# Altium project aig2_revA.PrjPcb
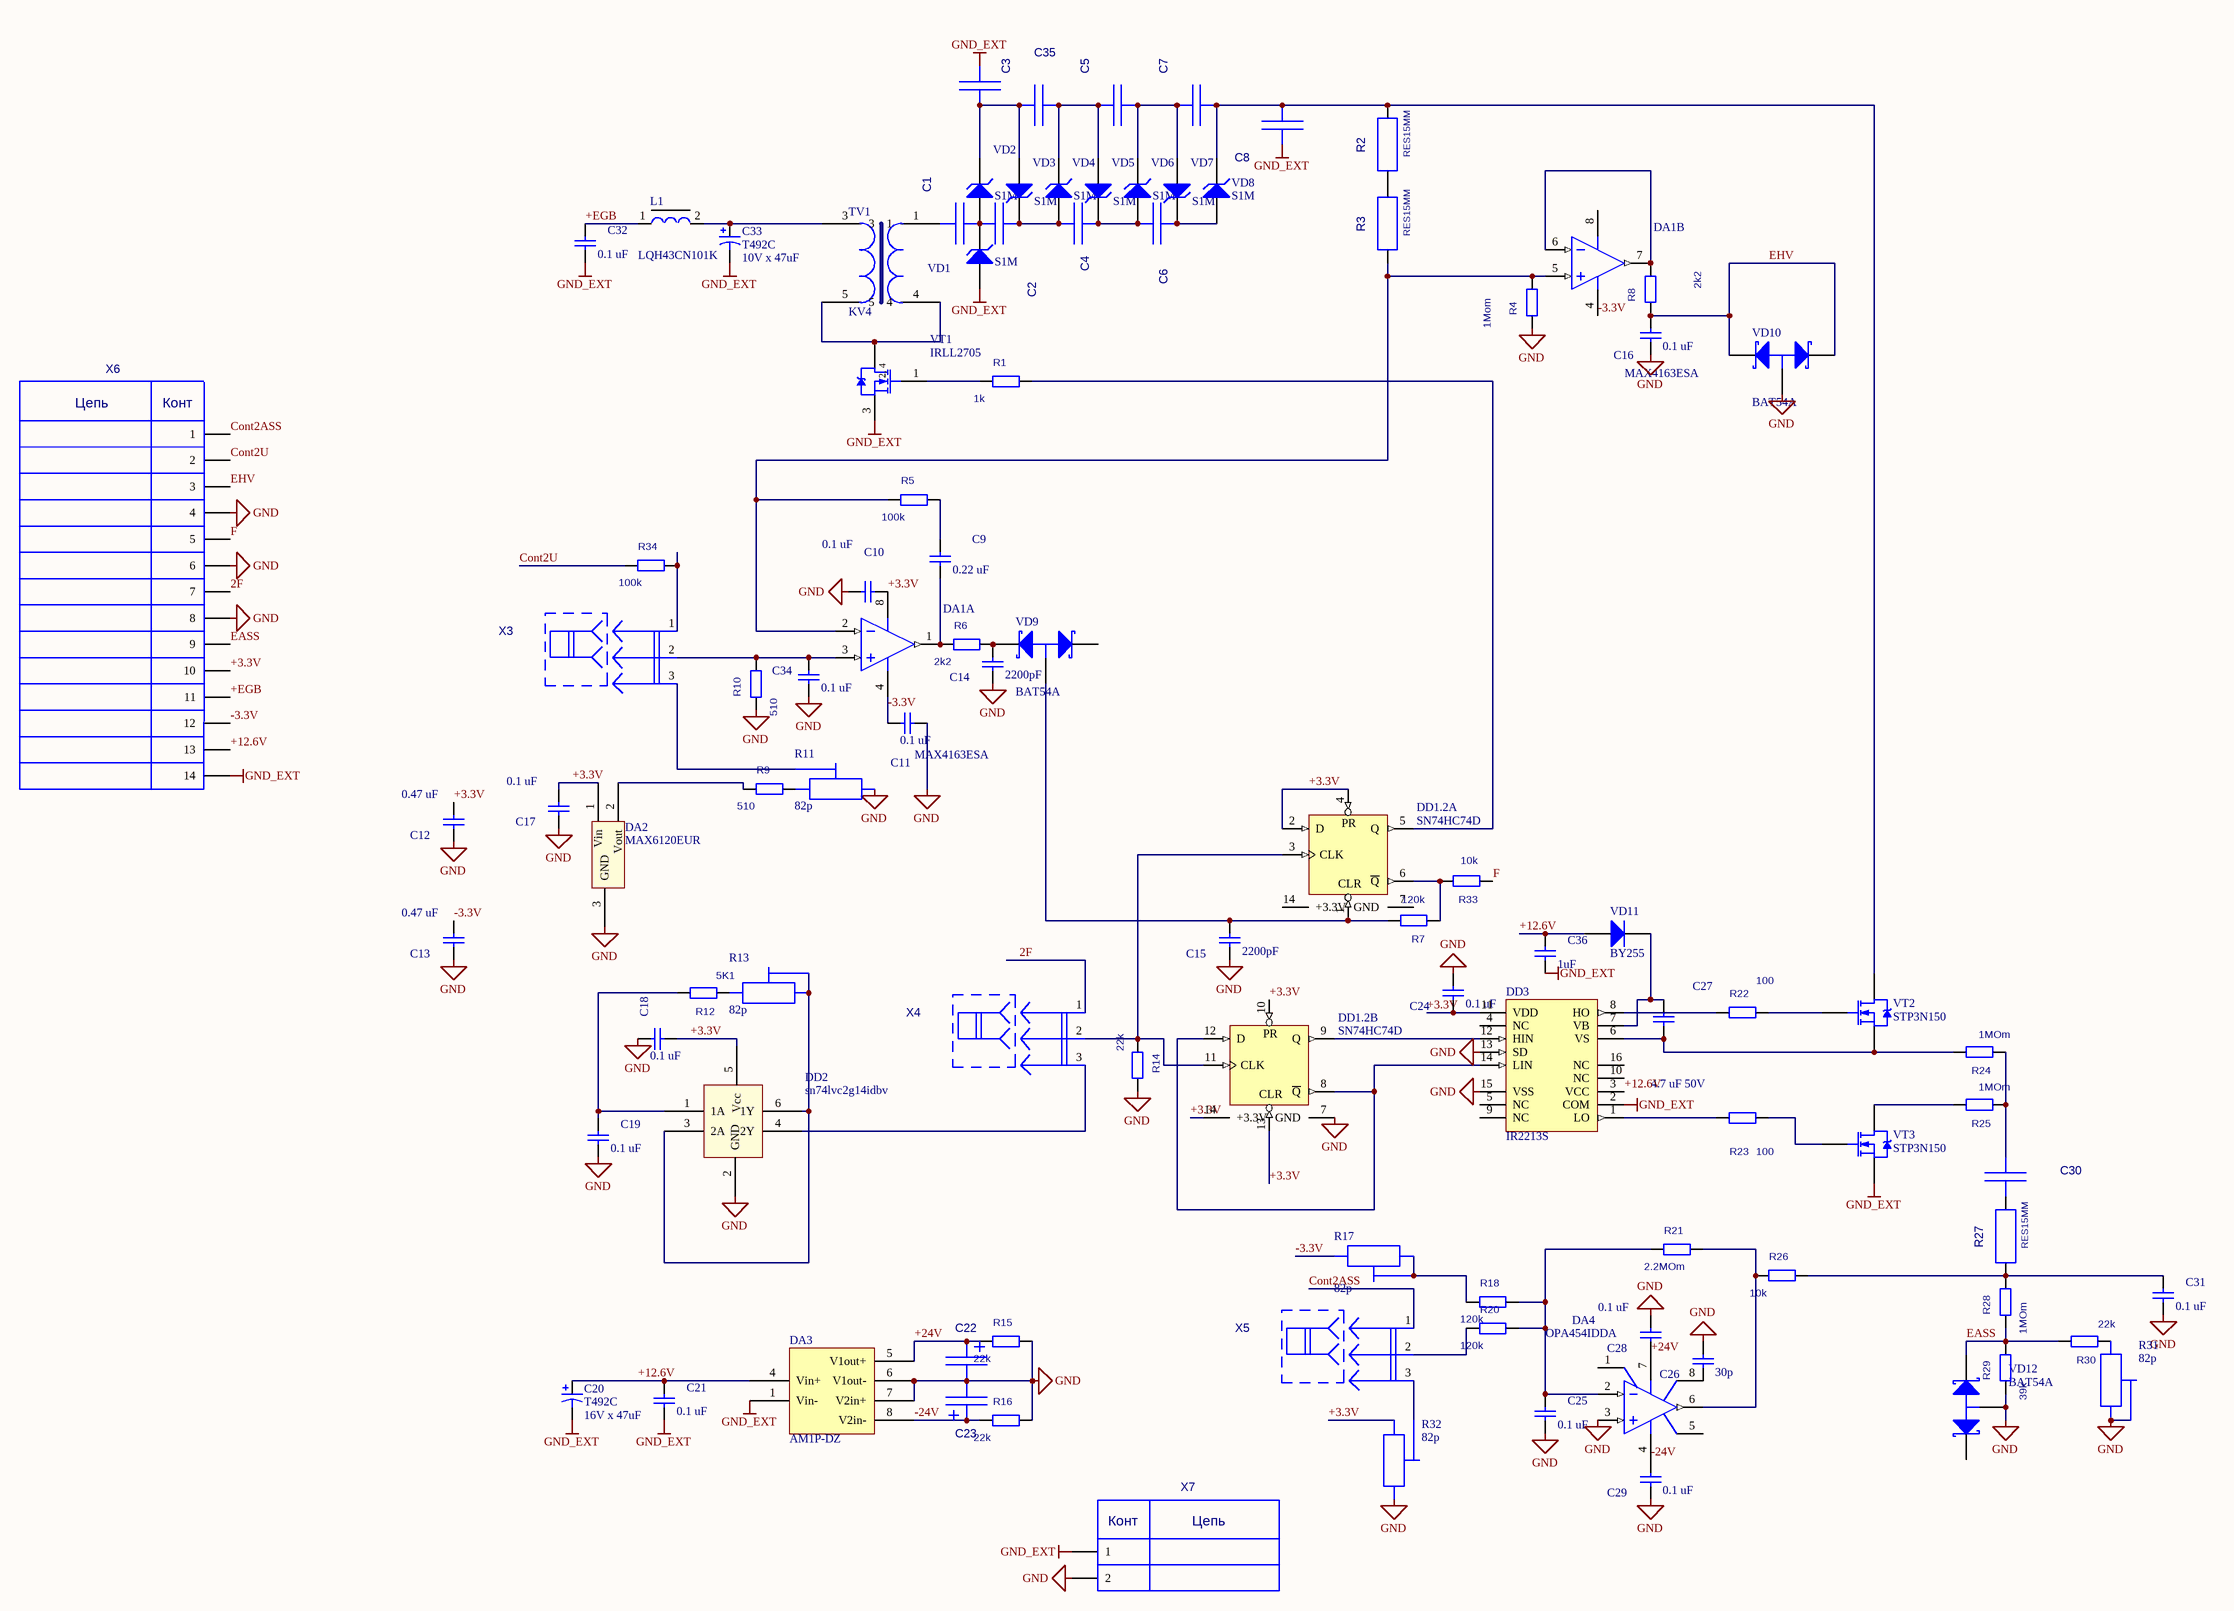
[diagram p0: aig2.SchDoc]
1 sheet, 98 parts. Net scope: global (net labels, ports and power ports of the same name join across sheets).
Board file: aig2.PcbDoc

## Sheet aig2.SchDoc
size A0

### Parts
C1  CC1812  [CC1812]  (value not drawn)
C2  CC1812  [CC1812]  (value not drawn)
C3  CC1812  [CC1812]  (value not drawn)
C4  CC1812  [CC1812]  (value not drawn)
C5  CC1812  [CC1812]  (value not drawn)
C6  CC1812  [CC1812]  (value not drawn)
C7  CC1812  [CC1812]  (value not drawn)
C8  CC1812  [CC1812]  (value not drawn)
C9  value 0.22 uF  [CC0805]  (hidden comment: C0805)
C10  value 0.1 uF  [CC0805]  (hidden comment: C0805)
C11  value 0.1 uF  [CC0805]  (hidden comment: C0805)
C12  value 0.47 uF  [CC0805]  (hidden comment: C0805)
C13  value 0.47 uF  [CC0805]  (hidden comment: C0805)
C14  value 2200pF  [CC0805]  (hidden comment: C0805)
C15  value 2200pF  [CC0805]  (hidden comment: C0805)
C16  value 0.1 uF  [CC0805]  (hidden comment: C0805)
C17  value 0.1 uF  [CC0805]  (hidden comment: C0805)
C18  value 0.1 uF  [CC0805]  (hidden comment: C0805)
C19  value 0.1 uF  [CC0805]  (hidden comment: C0805)
C20  T492C  value 16V x 47uF  [CAPASITOR C]
C21  value 0.1 uF  [CC0805]  (hidden comment: C0805)
C22  CAPASITOR A  [CAPASITOR A]  (value not drawn)
C23  CAPASITOR A  [CAPASITOR A]  (value not drawn)
C24  value 0.1 uF  [CC0805]  (hidden comment: C0805)
C25  value 0.1 uF  [CC0805]  (hidden comment: C0805)
C26  value 30p  [CC0805]  (hidden comment: C0805)
C27  value 4.7 uF 50V  [CC0805]  (hidden comment: C0805)
C28  value 0.1 uF  [CC0805]  (hidden comment: C0805)
C29  value 0.1 uF  [CC0805]  (hidden comment: C0805)
C30  CC1812  [CC1812]  (value not drawn)
C31  value 0.1 uF  [CC0805]  (hidden comment: C0805)
C32  value 0.1 uF  [CC0805]  (hidden comment: C0805)
C33  T492C  value 10V x 47uF  [CAPASITOR C]
C34  value 0.1 uF  [CC0805]  (hidden comment: C0805)
C35  CC1812  [CC1812]  (value not drawn)
C36  value 1uF  [CC0805]  (hidden comment: C0805)
DA1  MAX4163ESA  [NSO8_N]  (parts A,B of 2)
DA2  MAX6120EUR  [sot23]
DA3  AM1P-DZ  [Am1p]
DA4  OPA454IDDA  [182H_N]
DD1.2  SN74HC74D  [D014_N]  (parts A,B of 2)
DD2  sn74lvc2g14idbv  [sot23-6_N]
DD3  IR2213S  [SOIC16_N]
L1  LQH43CN101K  [1812]
R1  value 1k  [RR0805]
R2  RES15MM  [RES15MM]
R3  RES15MM  [RES15MM]
R4  value 1Mom  [RR0805]
R5  value 100k  [RR0805]
R6  value 2k2  [RR0805]
R7  value 120k  [RR0805]
R8  value 2k2  [RR0805]
R9  value 510  [RR0805]
R10  value 510  [RR0805]
R11  82p  [82p]
R12  value 5K1  [RR0805]
R13  82p  [82p]
R14  value 22k  [RR0805]
R15  value 22k  [RR0805]
R16  value 22k  [RR0805]
R17  82p  [82p]
R18  value 120k  [RR0805]
R20  value 120k  [RR0805]
R21  value 2.2MOm  [RR0805]
R22  value 100  [RR0805]
R23  value 100  [RR0805]
R24  value 1MOm  [RR0805]
R25  value 1MOm  [RR0805]
R26  value 10k  [RR0805]
R27  RES15MM  [RES15MM]
R28  value 1MOm  [RR0805]
R29  value 39k  [RR0805]
R30  value 22k  [RR0805]
R31  82p  [82p]
R32  82p  [82p]
R33  value 10k  [RR0805]
R34  value 100k  [RR0805]
TV1  KV4  [kv4]
VD1  S1M  [DO214]
VD2  S1M  [DO214]
VD3  S1M  [DO214]
VD4  S1M  [DO214]
VD5  S1M  [DO214]
VD6  S1M  [DO214]
VD7  S1M  [DO214]
VD8  S1M  [DO214]
VD9  BAT54A  [SOT23_N]
VD10  BAT54A  [SOT23_N]
VD11  BY255  [SOD27]
VD12  BAT54A  [SOT23_N]
VT1  IRLL2705  [SOT-223]
VT2  STP3N150  [TO-220AB]
VT3  STP3N150  [TO-220AB]
X3  JP3  [PLS-3 2.54]  (value not drawn)
X4  JP3  [PLS-3 2.54]  (value not drawn)
X5  JP3  [PLS-3 2.54]  (value not drawn)
X6  IDC14M  [IDC14M]  (value not drawn)
X7  PLS-2  [PLS-2 2.54]  (value not drawn)

### Nets
+3.3V: C10.2 C12.1 C17.1 C18.1 C24.2 DA1.8(VDD) DA2.1(Vin) DD1.2.2(D) DD1.2.4(PR) DD1.2.10(PR) DD1.2.13(CLR) DD1.2.14(+3.3V) DD2.5(Vcc) DD3.11(VDD) R32.1(I/O1) X6.10  [also labelled VCC]
GND: C10.1 C11.1 C12.2 C13.2 C14.2 C15.2 C16.2 C17.2 C18.2 C19.1 C22.2(i/o1) C23.2(i/o1) C24.1 C25.1 C26.1 C28.1 C29.2 C31.1 C34.1 DA2.3(GND) DA3.6(V1out-) DA3.7(V2in+) DA4.3(IN+) DD1.2.7(GND) DD2.2(GND) DD3.13(SD) DD3.15(VSS) R4.1 R10.1 R11.3(I/O) R14.2 R15.2 R16.2 R29.1 R31.1(I/O1) R31.2(I/O0) R32.3(I/O) VD10.3(A) VD12.3(A) X6.4 X6.6 X6.8 X7.2
GND_EXT: C8.1(i/o) C20.2 C21.1 C32.1 C33.2 C35.2(i/o1) C36.1 DA3.1(Vin-) DD3.2(COM) VD1.1(A) VT1.3(S) VT3.3(S) X6.14 X7.1
2F: X4.1(I/O1) X6.7
+12.6V: C20.1 C21.2 C36.2 DA3.4(Vin+) DD3.3(VCC) VD11.1(A) X6.13
+24V: C22.1(i/o) C28.2 DA3.5(V1out+) DA4.7(V+) R15.1
+EGB: C32.2 L1.1 X6.11
-3.3V: C11.2 C13.1 DA1.4(VSS) R17.3(I/O) X6.12
-24V: C23.1(i/o) C29.1 DA3.8(V2in-) DA4.4(V-) R16.1
Cont2ASS: X5.1(I/O1) X6.1
Cont2U: R34.1 X6.2
EASS: R28.1 R29.2 R30.2 VD12.1(K1) X6.9
EHV: C16.1 R8.1 VD10.1(K1) VD10.2(K2) X6.3
F: R33.1 X6.5
NetC1_1: C1.1(i/o) TV1.1
NetC1_2: C1.2(i/o1) C2.1(i/o) VD1.2(K) VD2.1(A)
NetC2_2: C2.2(i/o1) C4.1(i/o) VD3.2(K) VD4.1(A)
NetC3_1: C3.1(i/o) C35.1(i/o) VD2.2(K) VD3.1(A)
NetC3_2: C3.2(i/o1) C5.1(i/o) VD4.2(K) VD5.1(A)
NetC4_2: C4.2(i/o1) C6.1(i/o) VD5.2(K) VD6.1(A)
NetC5_2: C5.2(i/o1) C7.1(i/o) VD6.2(K) VD7.1(A)
NetC6_2: C6.2(i/o1) VD7.2(K) VD8.1(A)
NetC7_2: C7.2(i/o1) C8.2(i/o1) R2.2(I/O1) VD8.2(K) VT2.2(D)
NetC9_1: C9.1 R5.2
NetC9_2: C9.2 DA1.1(OUT) R6.1
NetC14_1: C14.1 R6.2 VD9.1(K1)
NetC15_1: C15.1 DD1.2.1(CLR) R7.2 VD9.3(A)
NetC19_2: C19.2 DD2.1(1A) R12.2
NetC25_2: C25.2 DA4.2(IN-) R18.2 R20.2 R21.1
NetC26_2: C26.2 DA4.8(VOSTRIM)
NetC27_1: C27.1 DD3.6(VS) R24.2 VT2.3(S)
NetC27_2: C27.2 DD3.7(VB) VD11.2(K)
NetC30_1: C30.1(i/o) R24.1 R25.1
NetC30_2: C30.2(i/o1) R27.2(I/O1)
NetC31_2: C31.2 R26.2 R27.1(I/O0) R28.2
NetC33_1: C33.1 L1.2 TV1.3
NetC34_2: C34.2 DA1.3(IN+) R10.2 X3.2(I/O2)
NetDA1_2: DA1.2(IN-) DA1.5(IN+) R3.1(I/O0) R4.2 R5.1
NetDA1_6: DA1.6(IN-) DA1.7(OUT) R8.2
NetDA2_2: DA2.2(Vout) R9.1
NetDA4_6: DA4.6(OUT) R21.2 R26.1
NetDD1.2_3: DD1.2.3(CLK) DD1.2.11(CLK) R14.1 X4.2(I/O2)
NetDD1.2_5: DD1.2.5(Q) R1.2
NetDD1.2_6: DD1.2.6(~{Q}) R7.1 R33.2
NetDD1.2_8: DD1.2.8(~{Q}) DD1.2.12(D) DD3.14(LIN)
NetDD1.2_9: DD1.2.9(Q) DD3.12(HIN)
NetDD2_3: DD2.3(2A) DD2.6(1Y) R13.1(I/O1) R13.2(I/O0)
NetDD2_4: DD2.4(2Y) X4.3(I/O3)
NetDD3_1: DD3.1(LO) R23.1
NetDD3_8: DD3.8(HO) R22.1
NetR1_1: R1.1 VT1.1(G)
NetR2_1: R2.1(I/O0) R3.2(I/O1)
NetR9_2: R9.2 R11.1(I/O1)
NetR11_2: R11.2(I/O0) X3.3(I/O3)
NetR12_1: R12.1 R13.3(I/O)
NetR17_1: R17.1(I/O1) R17.2(I/O0) R18.1
NetR20_1: R20.1 X5.2(I/O2)
NetR22_2: R22.2 VT2.1(G)
NetR23_2: R23.2 VT3.1(G)
NetR25_2: R25.2 VT3.2(D)
NetR30_1: R30.1 R31.3(I/O)
NetR32_2: R32.2(I/O0) X5.3(I/O3)
NetR34_2: R34.2 X3.1(I/O1)
NetTV1_4: TV1.4 TV1.5 VT1.2(D) VT1.4(D)

Not connected (* = marked no-connect by the designer): DA4 1(VOSTRIM) 5(NC); DD3 4(NC) 5(NC) 9(NC) 10(NC) 16(NC); VD9 2(K2); VD12 2(K2)

### Notes on the sheet
- (in symbol IDC14M) Цепь; Конт
- (in symbol IRLL2705) 2, 4
- (in symbol PLS-2) Конт; Цепь

### Library data of the parts
C1-C7 C30 C35 = CC1812: Value: 2200 x 1kV
C8 = CC1812: Value: 2200 x 3kV
C9-C19 C21 C24-C29 C31 C32 C34 C36 = C0805: Ceramic Chip Capacitor - Standard; Note: Footprint corresponds to dimensions for bulk cassette packaging. This case size has tightened tolerances.; Published: 17-Jul-2002; LatestRevisionDate: 19-Mar-2004; LatestRevisionNote: Silkscreen size reduced.; DatasheetDocument: Mar-2001; PackageDocument: Mar-2001; PackageReference: 0805; Publisher: Altium Limited; Code_JEITA: 0805; Code_IPC: 2012[0805]; ComponentLink1Description: Manufacturer Link; ComponentLink1URL: http://www.kemet.com/; ComponentLink2Description: Datasheet; ComponentLink2URL: http://www.kemet.com/kemet/web/homepage/kechome.nsf/vapubfilesname/F3102TA.pdf/$file/F3102TA.pdf
C20 C33 = T492C: Solid Tantalum Chip Capacitor, T492 Series - CWR11 Style Per Mil-PRF-55365/8; Published: 17-Jul-2002; LatestRevisionDate: 19-Mar-2004; LatestRevisionNote: Silkscreen dimensions re-sized.; DatasheetDocument: Mar-2001; PackageDocument: Mar-2001; PackageReference: C; Publisher: Altium Limited; Code_JEITA: 6032-28; ComponentLink1Description: Manufacturer Link; ComponentLink1URL: http://www.kemet.com/; ComponentLink2Description: Datasheet; ComponentLink2URL: http://www.kemet.com/kemet/web/homepage/kechome.nsf/vapubfilesname/F3102TA.pdf/$file/F3102TA.pdf
DA1 = MAX4163ESA: Dual Micropower, Single-Supply, Rail-to-Rail I/O Op Amp; Published: 23-Sep-2002; LatestRevisionDate: 13-Apr-2006; LatestRevisionNote: IPC-7351 Footprint Added.; DatasheetVersion: Rev 0; 4/97; PackageReference: NSO8; Publisher: Altium Limited; PackageDescription: 8-Pin Small Outline Integrated Circuit 1.27 mm Pitch; Code_JEDEC: MS-012-AA; Code_IPC: SOIC127P600-8; ComponentLink1Description: Manufacturer Link; ComponentLink1URL: http://www.maxim-ic.com/; ComponentLink2Description: Datasheet; ComponentLink2URL: http://pdfserv.maxim-ic.com/en/ds/MAX4162-MAX4164.pdf
DA2 = MAX6120: Микросхема
DA3 = AM1P-DZ: DC/DC Перобразователь
DA4 = OPA27GU: Ultra-Low-Noise Precision Operational Amplifiers; Note: Pin 5 is No internal Connection (NC) pin.; Published: 8-Jun-2000; LatestRevisionDate: 13-Apr-2006; LatestRevisionNote: IPC-7351 Footprint Added.; DatasheetVersion: Mar-1998; PackageReference: 182H; Publisher: Altium Limited; PackageDescription: 8-Pin Small Outline Integrated Circuit 1.27 mm Pitch; Code_JEDEC: MS-012-AA; Code_IPC: SOIC127P600-8; ComponentLink1Description: Manufacturer Link; ComponentLink1URL: http://www.ti.com/; ComponentLink2Description: Datasheet; ComponentLink2URL: http://www-s.ti.com/sc/ds/OPA27.pdf
DD1.2 = SN74HC74D: Dual D-Type Positive-Edge-Triggered Flip-Flop with Clear and Preset; Published: 8-Jun-2000; LatestRevisionDate: 13-Apr-2006; LatestRevisionNote: IPC-7351 Footprint Added.; DatasheetVersion: May-1997; PackageVersion: Jan-1998; PackageReference: D014; Publisher: Altium Limited; PackageDescription: 14-Pin Small Outline Integrated Circuit 1.27 mm Pitch; Code_IPC: SOIC127P600-14; ComponentLink1Description: Manufacturer Link; ComponentLink1URL: http://www.ti.com/; ComponentLink2Description: Datasheet; ComponentLink2URL: http://www-s.ti.com/sc/ds/sn74hc74.pdf
DD2 = sn74lvc2g14idbv: Микросхема
DD3 = IR2113S: High and Low Side Driver; Note: Pins 4, 5, 9, 10 and 16 are not connected; Published: 8-Jun-2000; LatestRevisionDate: 13-Apr-2006; LatestRevisionNote: IPC-7351 Footprint Added.; DatasheetVersion: PD60147J; PackageReference: SOIC16; Publisher: Altium Limited; PackageDescription: 16-Pin Small Outline Integrated Circuit 1.27 mm Pitch; Code_JEDEC: MS-013-AA; Code_IPC: SOIC127P1030-16; ComponentLink1Description: Manufacturer Link; ComponentLink1URL: http://www.irf.com/; ComponentLink2Description: Datasheet; ComponentLink2URL: http://www.irf.com/product-info/datasheets/data/ir2110.pdf
L1 = CDRH127: Дроссель
R1 R4-R10 R12 R14-R16 R18 R20-R26 R28-R30 R33 R34 = R_0805: Price: {Price}
R11 R13 R17 R31 R32 = 82p: Резистор; Value: *
TV1 = KV4: Трансформатор
VD1-VD8 = BZG03C10: Silicon Zener Diode (3W); Published: 8-Jun-2000; LatestRevisionDate: 17-Jul-2002; LatestRevisionNote: Re-released for DXP Platform.; DatasheetDocument: 1-Apr-1999; PackageDocument: Apr-1999; PackageReference: DO214; Publisher: Altium Limited; ComponentLink1Description: Manufacturer Link; ComponentLink1URL: http://www.vishay.com/; ComponentLink2Description: Datasheet; ComponentLink2URL: http://www.vishay.com/docs/85593/85593.pdf
VD9 VD10 VD12 = BAT54A: Schottky Barrier Double Diode; Published: 17-Sep-2003; LatestRevisionDate: 12-Dec-2006; LatestRevisionNote: IPC-7351 Footprint Added.; DatasheetVersion: 4-Mar-2002; PackageVersion: May-1999; PackageReference: SOT23; Publisher: Altium Limited; PackageDescription: 3-Pin SOT-23 Package 0.95 mm Pitch, 2.3 mm Lead Span; ComponentLink1Description: Manufacturer Link; ComponentLink1URL: http://www.semiconductors.philips.com/; ComponentLink2Description: Datasheet; ComponentLink2URL: http://www.semiconductors.philips.com/acrobat/datasheets/BAT54_SERIES_4.pdf
VD11 = BZX79-B15: Диод; Code_IEC: A24; Published: 17-Sep-2003; DatasheetVersion: 27-Feb-2002; PackageVersion: Apr-1999; PackageReference: SOD27; Publisher: Altium Limited; PackageDescription: Diode, Axial; Body 4.3 x 1.9 mm (LxDia. max), Lead Dia. 0.56 mm (max); Code_JEITA: SC-40; Code_JEDEC: DO-35; ComponentLink1Description: Manufacturer Link; ComponentLink1URL: http://www.semiconductors.philips.com/; ComponentLink2Description: Datasheet; ComponentLink2URL: http://www.semiconductors.philips.com/acrobat/datasheets/BZX79_3.pdf
VT1 = IRLL2705: HEXFET Power MOSFET; Note: Pin 2 is electrically connected to pin 4.; Published: 8-Jun-2000; LatestRevisionDate: 17-Jul-2002; LatestRevisionNote: Re-released for DXP Platform.; DatasheetVersion: Jan-1999; PackageReference: SOT-223; Publisher: Altium Limited; PackageDescription: SOT-223/SC-73; 4 Leads; Body 6.7 x 7.3 mm, inc. leads (LxW max); Code_JEDEC: TO-261-AA; Code_IPC: SOT 223; ComponentLink1Description: Manufacturer Link; ComponentLink1URL: http://www.irf.com/; ComponentLink2Description: Datasheet; ComponentLink2URL: http://www.irf.com/product-info/datasheets/data/irll2705.pdf
VT2 VT3 = IRF740: HEXFET N-Channel Power MOSFET; Note: Pin 2 is electrically connected to pin 4.; Published: 8-Jun-2000; LatestRevisionDate: 17-Jul-2002; LatestRevisionNote: Re-released for DXP Platform.; DatasheetVersion: PD-9.375H; PackageVersion: Feb-1997; PackageReference: TO-220AB; Publisher: Altium Limited; PackageDescription: TO, Thru-Hole, Vertical, Heatsink Mounted; 3 In-Line Leads; Pitch 2.54 mm; ComponentLink1Description: Manufacturer Link; ComponentLink1URL: http://www.irf.com/; ComponentLink2Description: Datasheet; ComponentLink2URL: http://www.irf.com/product-info/datasheets/data/irf740.pdf
C22 C23 = CAPASITOR A: Value: *
R2 R3 R27 = RES15MM: Value: *
X3-X5 = JP3: Value: *
X6 = IDC14M: Value: *
X7 = PLS-2: Value: *